# EAGLE design Candle (EAGLE 6.4)
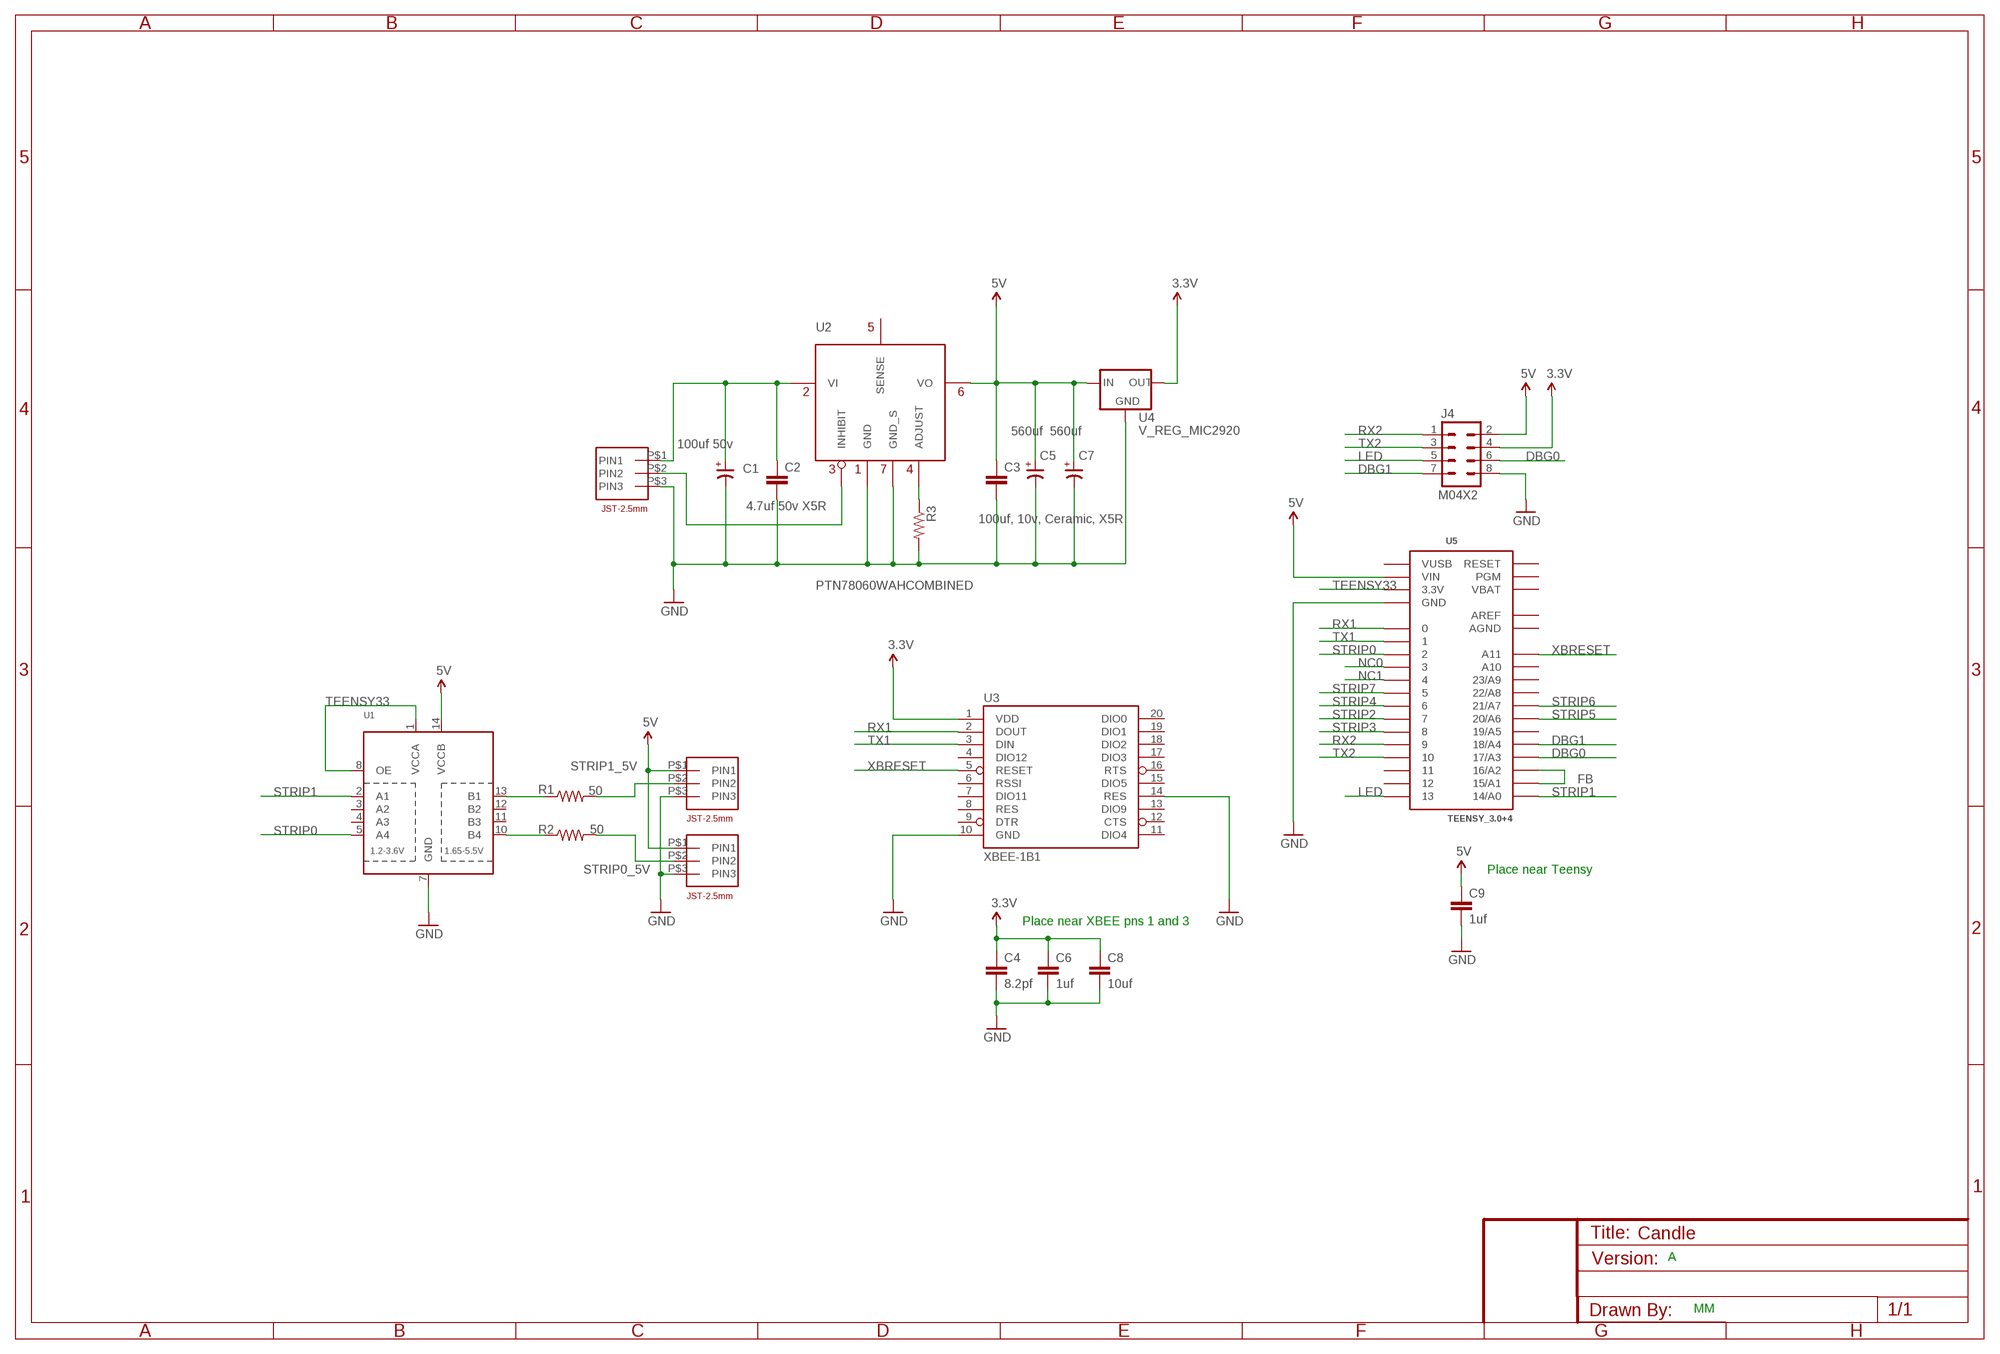
[diagram p0: schematic, sheet 1]

## Parts
C1  100uf 50v  CP-SV-G  [SV-G]
C2  4.7uf 50v X5R  C-EUC3225  [C3225]
C3  100uf, 10v, Ceramic, X5R  C-EUC3225  [C3225]
C4  8.2pf  C-EUC3225  [C3225]
C5  560uf  CP-SV-G  [SV-G]
C6  1uf  C-EUC3225  [C3225]
C7  560uf  CP-SV-G  [SV-G]
C8  10uf  C-EUC3225  [C3225]
C9  1uf  C-EUC3225  [C3225]
J1  JST-XH-2.5MM-SIDE-3  [JST-XH-2.5MM-SIDE-3]
J2  JST-XH-2.5MM-SIDE-3  [JST-XH-2.5MM-SIDE-3]
J3  JST-XH-2.5MM-SIDE-3  [JST-XH-2.5MM-SIDE-3]
J4  M04X2  [2X4]
R1  50  R-US_R0805  [R0805]
R2  50  R-US_R0805  [R0805]
R3  R-US_R0805  [R0805]
U1  TXB0104PWRSOIC14  [SO14]
U2  PTN78060WAHCOMBINED  [COMBINED]
U3  XBEE-1B1  [XBEE-1]
U4  V_REG_MIC2920  [SOT223]
U5  TEENSY_3.0+4  [TEENSY_3.0+4]

## Nets
3.3V: C4.1 C6.1 C8.1 J4.4 U3.1(VDD) U4.3(OUT)
5V: C3.1 C5.+ C7.+ C9.1 J2.P$1(PIN1) J3.P$1(PIN1) J4.2 U1.14(VCCB) U2.VOUT(VO) U2.VOUT_S(VO) U4.1(IN) U5.VIN
DBG0: J4.6 U5.17/A3
DBG1: J4.7 U5.18/A4
FB: U5.15/A1 U5.16/A2
GND: C1.- C2.2 C3.2 C4.2 C5.- C6.2 C7.- C8.2 C9.2 J1.P$3(PIN3) J2.P$3(PIN3) J3.P$3(PIN3) J4.8 R3.2 U1.7(GND) U2.GND U2.GND_S(GND) U2.S/GND(GND_S) U2.S/GND_S(GND_S) U3.10(GND) U3.14(RES) U4.2(GND) U4.4(GND) U5.GND U5.GND1(GND)
LED: J4.5 U5.13
N$2: R1.1 U1.13(B1)
N$3: J1.P$2(PIN2) U2.EN(INHIBIT)
N$7: R2.1 U1.10(B4)
NC0: U5.3
NC1: U5.4
RX1: U3.2(DOUT) U5.0
RX2: J4.1 U5.9
STRIP0: U1.5(A4) U5.2
STRIP0_5V: J3.P$2(PIN2) R2.2
STRIP1: U1.2(A1) U5.14/A0
STRIP1_5V: J2.P$2(PIN2) R1.2
STRIP2: U5.7
STRIP3: U5.8
STRIP4: U5.6
STRIP5: U5.20/A6
STRIP6: U5.21/A7
STRIP7: U5.5
TEENSY33: U1.1(VCCA) U1.8(OE) U5.3.3V U5.3.3V1(3.3V)
TX1: U3.3(DIN) U5.1
TX2: J4.3 U5.10
VADJ: R3.1 U2.ADJUST
VIN: C1.+ C2.1 J1.P$1(PIN1) U2.VIN(VI) U2.VIN_S(VI)
XBRESET: U3.5(RESET) U5.A11
Unconnected: U1.3(A2) U1.4(A3) U1.11(B3) U1.12(B2) U2.SENSE U3.4(DIO12) U3.6(RSSI) U3.7(DIO11) U3.8(RES) U3.9(DTR) U3.11(DIO4) U3.12(CTS) U3.13(DIO9) U3.15(DIO5) U3.16(RTS) U3.17(DIO3) U3.18(DIO2) U3.19(DIO1) U3.20(DIO0) U5.11 U5.12 U5.19/A5 U5.22/A8 U5.23/A9 U5.A10 U5.PGM U5.RESET

## Notes on the sheet
- Place near Teensy
- Place near XBEE pns 1 and 3
- A
- MM

## Power pins joined to a net without a drawn wire
AGND: U5.AGND
AREF: U5.AREF
VBAT: U5.VBAT
VUSB: U5.VUSB

## Library data of the parts
C1 C5 C7 = cap-master:CP-: POLARIZED CAP
C2-C4 C6 C8 C9 = resistor:C-EU: CAPACITOR, European symbol
J1-J3 = MyLibrary:JST-XH-2.5MM-SIDE-3
J4 = SparkFun-Connectors:M04X2: .1" header, two rows of four.
R1-R3 = rcl:R-US_: RESISTOR, American symbol
U1 = SparkFun-DigitalIC:TXB0104PWR: 4-Bit Bi-Directional Level Shifter 1.2V-3.6V (VCCA) to 1.65V-5.5V (VCCB) bi-directional level shifter with auto direction sensing. Max data rate - VCCA 1.8V: 20Mbps (50ns), VCCA 3.3V: 100Mbps (10ns) Digikey: 296-21929-1-ND (TSSOP) IC-11329; PROD_ID: IC-11329
U2 = ptn78060wah:PTN78060WAH
U3 = SparkFun-RF:XBEE-1: Xbee module footprints SMT header is CONN-09042.
U4 = SparkFun-PowerIC:V_REG_MIC2920: MIC2920A (http://www.micrel.com/_PDF/mic2920.pdf) - 400mA output LDO Regulator
U5 = Teensy3.0:TEENSY_3.0+4: Teensy 3.0 board, showing all pins that are easily acessible. See 'AllAnalogPins" and 'AllPins' packages for additional pin holes, as needed. The 'Basic' package has fewer pins.

## Board
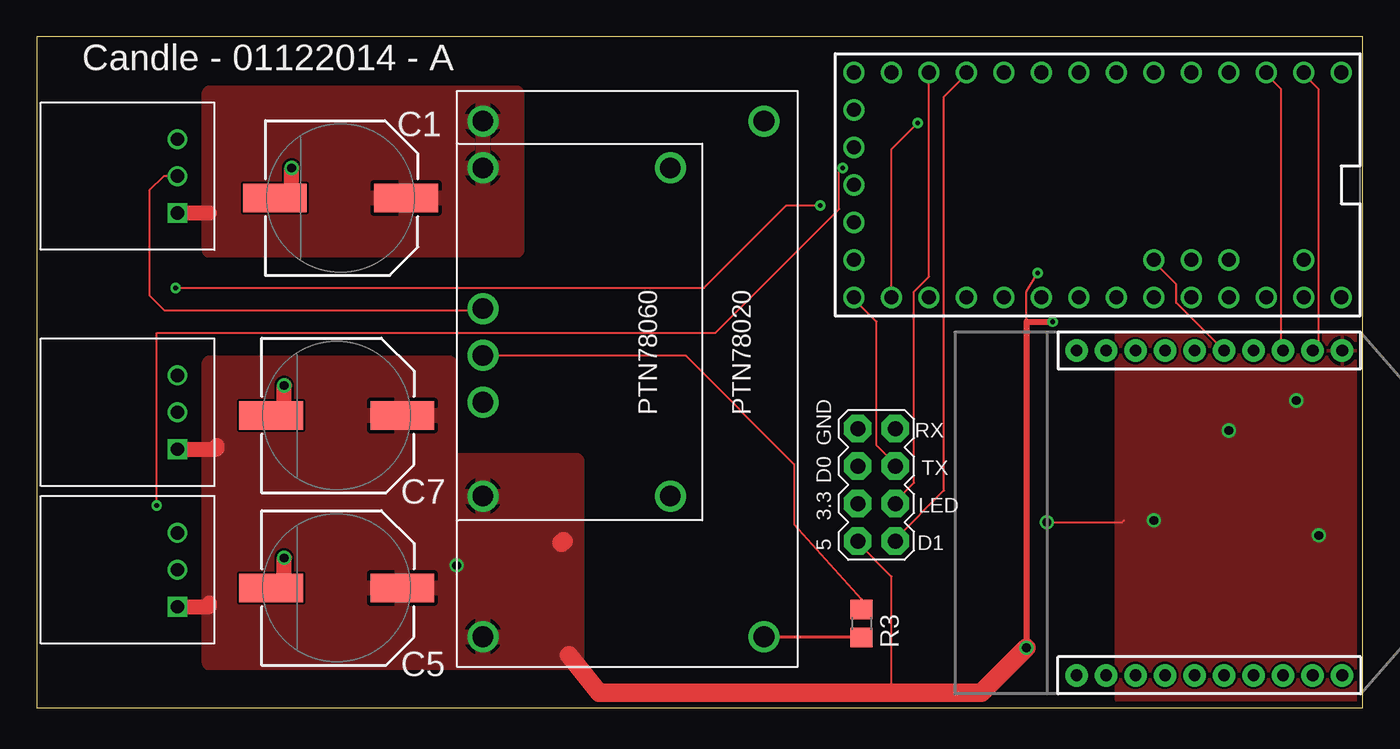
[diagram p1: board, top side]
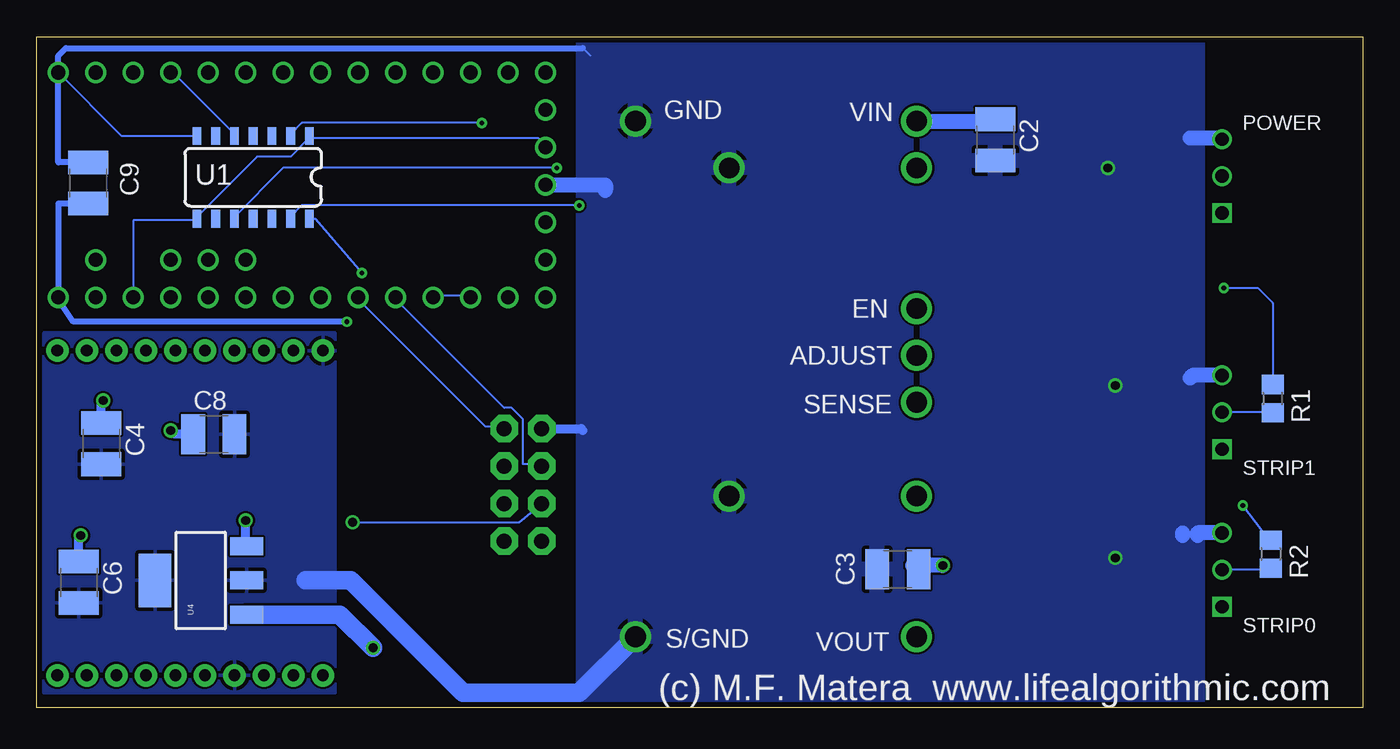
[diagram p2: board, bottom side, seen from below]

Size 89.84 x 45.46 mm. Coordinates in mm from the lower left corner, seen from the top.
Outline: 0,0 89.84,0 89.84,45.46 0,45.46 0,0
Copper layers (1*16): Top 0.0356mm / dielectric 1.5011mm / Bottom 0.0356mm
Design rules "LaenPCBOrder": minimum track width 6mil, minimum drill 13mil, track to track 6mil, track to pad 6mil, pad to pad 6mil, via to via 6mil, smd to smd 6mil, copper to edge 15mil, drill to drill 6mil, minimum pad ring 7mil, minimum via ring 7mil, stop-mask expansion 3mil, vias tented up to drill 0mil, thermal gap 10mil

### Footprints (pad centres in the part's own frame; a part is rotated, then mirrored left to right if it is on the bottom)
SV-G = smd 4.318 x 1.93: + -4.445,0; - 4.445,0
C3225 = smd 1.6 x 2.7: 1 -1.4,0; 2 1.4,0
JST-XH-2.5MM-SIDE-3 = drill 0.9 square: P$1 0,0 | drill 0.9: P$2 2.5,0; P$3 5,0
2X4 = drill 1.016 pad 1.88 octagon: 1 -3.81,-1.27; 2 -3.81,1.27; 3 -1.27,-1.27; 4 -1.27,1.27; 5 1.27,-1.27; 6 1.27,1.27; 7 3.81,-1.27; 8 3.81,1.27
R0805 = smd 1.3 x 1.5: 1 -0.95,0; 2 0.95,0
SO14 = smd 0.6 x 1.2: 1 -3.81,-2.8; 2 -2.54,-2.8; 3 -1.27,-2.8; 4 0,-2.8; 5 1.27,-2.8; 6 2.54,-2.8; 7 3.81,-2.8; 8 3.81,2.8; 9 2.54,2.8; 10 1.27,2.8; 11 0,2.8; 12 -1.27,2.8; 13 -2.54,2.8; 14 -3.81,2.8
COMBINED = drill 1.4: ADJUST 0,0.001; EN -3.175,0.001; GND -15.875,19.051; GND_S -12.7,12.701; S/GND 19.05,19.051; S/GND_S 9.525,12.701; SENSE 3.175,0.001; VIN -15.875,0.001; VIN_S -12.7,0.001; VOUT 19.05,0.001; VOUT_S 9.525,0.001
XBEE-1 = drill 0.8 pad 1.524: 1 -11,20; 2 -11,18; 3 -11,16; 4 -11,14; 5 -11,12; 6 -11,10; 7 -11,8; 8 -11,6; 9 -11,4; 10 -11,2; 11 11,2; 12 11,4; 13 11,6; 14 11,8; 15 11,10; 16 11,12; 17 11,14; 18 11,16; 19 11,18; 20 11,20
SOT223 = smd 1.219 x 2.235: 1 -2.311,-3.099; 2 0,-3.099; 3 2.311,-3.099 | smd 3.6 x 2.2: 4 0,3.099
TEENSY_3.0+4 = drill 0.965: 0 -7.62,13.97; 1 -7.62,11.43; 2 -7.62,8.89; 3 -7.62,6.35; 3.3V 7.62,11.43; 3.3V1 -2.54,-16.51; 4 -7.62,3.81; 5 -7.62,1.27; 6 -7.62,-1.27; 7 -7.62,-3.81; 8 -7.62,-6.35; 9 -7.62,-8.89; 10 -7.62,-11.43; 11 -7.62,-13.97; 12 -7.62,-16.51; 13 7.62,-16.51; 14/A0 7.62,-13.97; 15/A1 7.62,-11.43; 16/A2 7.62,-8.89; 17/A3 7.62,-6.35; 18/A4 7.62,-3.81; 19/A5 7.62,-1.27; 20/A6 7.62,1.27; 21/A7 7.62,3.81; 22/A8 7.62,6.35; 23/A9 7.62,8.89; A10 5.08,6.35; A11 5.08,3.81; AGND 7.62,13.97; AREF 5.08,8.89; GND -7.62,16.51; GND1 0,-16.51; PGM 2.54,-16.51; RESET 5.08,-16.51; VBAT -5.08,-16.51; VIN 7.62,16.51; VUSB 5.08,13.97

### Placement (x,y rotation side)
C1  20.57,34.54 180 top
C2  24.89,38.48 270 bottom
C3  31.5,9.4 180 bottom
C4  85.47,17.91 270 bottom
C5  20.32,8.13 180 top
C6  87,8.51 270 bottom
C7  20.32,19.81 180 top
C8  77.85,18.54 0 bottom
C9  86.36,35.56 90 bottom
J1  9.53,33.53 90 top
J2  9.53,17.53 90 top
J3  9.53,6.86 90 top
J4  56.9,15.11 90 top
R1  6.1,20.95 270 bottom
R2  6.22,10.41 270 bottom
R3  55.88,5.71 270 top
U1  75.18,35.94 180 bottom
U2  30.23,23.88 270 top
U3  68.45,13.21 270 top
U4  78.74,8.64 90 bottom
U5  71.88,35.43 270 top

### Tracks (layer width: path | path; a pad name or v marks a point on that pad's centre or on a via)
3.3V  (via drill 0.6)
  Top 0.152: 55.63,13.72 J4.4 | v68.45,12.57 73.53,12.57 73.66,12.7
  Bottom 0.152: v68.45,12.57 57.15,12.57 J4.4
  Bottom 0.61: U4.3 75.69,10.95 v75.69,12.7 | C8.1 80.52,18.54 v80.77,18.8 | C4.1 85.47,20.7 v85.34,20.83 | C6.1 87,11.56 v86.87,11.68
  pour Top: 73.15,25.4 89.41,25.4 89.41,0.51 73.15,0.51
5V  (via drill 0.33, 0.6)
  Top 0.152: 57.91,1.02 57.91,8.89 55.63,11.18 J4.2 | v67.82,29.46 67.06,28.19 67.06,26.16
  Top 0.406: v68.83,26.16 67.06,26.16 v67.06,4.06
  Top 1.016: J3.P$1 11.68,6.86 11.68,7.11 | J2.P$1 12.19,17.53 12.19,17.78
  Top 1.27: 35.69,11.3 35.56,11.18 | v67.06,4.06 64.01,1.02 57.91,1.02 38.1,1.02 36.07,3.56
  Bottom 0.152: 88.39,27.69 U5.VIN | U1.14 70.99,33.14 v67.82,29.46
  Bottom 0.406: 88.39,27.69 87.38,26.16 v68.83,26.16 | C9.1 88.39,34.16 U5.VIN
  Bottom 1.016: C3.1 30.48,9.65 29.97,10.16 29.46,9.65 v28.45,9.65
  Bottom 1.27: v67.06,4.06 69.32,6.33 U4.1
  pour Top: 11.68,23.37 27.94,23.37 27.94,16.76 36.58,16.76 36.58,3.05 11.68,3.05
DBG0
  Bottom 0.152: U5.17/A3 65.53,27.69 58.17,20.32 57.66,20.32 56.9,19.56 56.9,16.51 55.63,16.51 J4.6
DBG1
  Bottom 0.152: U5.18/A4 68.07,27.69 59.44,19.05 58.17,19.05 J4.7
FB
  Bottom 0.152: U5.15/A1 60.45,27.94 62.99,27.94 U5.16/A2
GND  (via drill 0.6)
  Top 0.152: 55.63,19.05 J4.8
  Top 0.203: U2.S/GND 55.82,4.83 R3.2
  Top 1.016: 15.24,8.13 C5.- 16.76,8.13 v16.76,10.16 | 15.24,19.81 C7.- 16.76,19.81 v16.76,21.84 | 15.75,34.54 C1.- 17.27,34.54 v17.27,36.58
  Bottom 0.152: 52.83,44.7 52.32,44.2 | U1.7 84.08,38.74 U5.GND
  Bottom 0.406: 52.83,44.7 87.88,44.7 88.39,44.2 U5.GND 88.39,36.96 C9.2
  Bottom 0.61: J4.8 52.96,18.92 52.83,18.8
  Bottom 1.016: J1.P$3 9.65,38.61 11.68,38.61 | 12.19,11.86 12.19,11.68 | J2.P$3 11.51,22.53 11.68,22.35 | U5.GND1 51.31,35.43 51.31,35.05 | J3.P$3 11.18,11.86 11.18,11.68
  Bottom 1.27: U2.S/GND 53.09,1.02 60.96,1.02 68.58,8.64 71.63,8.64
  pour Bottom: 11.18,45.21 52.83,45.21 52.83,0.51 11.18,0.51
  pour Bottom: 69.6,25.4 89.41,25.4 89.41,1.02 69.6,1.02
LED
  Top 0.152: U5.13 55.37,27.69 56.9,26.16 56.9,17.78 58.17,16.51 J4.5
N$2  (via drill 0.33)
  Top 0.152: v9.4,28.45 45.21,28.45 50.8,34.04 v53.09,34.04
  Bottom 0.152: v53.09,34.04 71.88,34.04 72.64,33.27 U1.13 | 6.1,22.1 R1.1 6.1,27.43 7.11,28.45 v9.4,28.45
N$3
  Top 0.152: 30.23,27.18 U2.EN 30.1,26.92 8.64,26.92 7.62,27.94 7.62,35.05 8.6,36.03 J1.P$2
N$7  (via drill 0.33)
  Top 0.152: v54.61,36.58 54.36,36.32 54.36,33.78 45.97,25.4 8.13,25.4 v8.13,13.72
  Bottom 0.152: v54.61,36.58 73.15,36.58 76.45,33.27 U1.10 | v8.13,13.72 6.35,11.43 R2.1
RX1
  Top 0.152: U5.0 85.85,42.93 86.87,41.91 86.87,24.64 86.61,24.38 U3.2
RX2
  Top 0.152: U5.9 62.99,42.93 61.47,41.4 61.47,14.73 58.17,11.43 J4.1
STRIP0
  Bottom 0.152: U1.5 76.45,38.86 80.52,42.93 80.77,42.93 U5.2
STRIP0_5V
  Bottom 0.152: R2.2 6.35,9.4 9.4,9.4 J3.P$2
STRIP1  (via drill 0.33)
  Top 0.152: v59.69,39.62 57.91,37.85 U5.14/A0
  Bottom 0.152: v59.69,39.62 71.88,39.62 72.64,38.86 U1.2
STRIP1_5V
  Bottom 0.152: R1.2 6.1,20.07 9.4,20.07 J2.P$2
TEENSY33
  Bottom 0.152: 71.37,38.61 72.64,37.34 74.93,37.34 78.99,33.27 U1.8 78.99,33.02 83.31,33.02 U5.3.3V | 71.37,38.61 55.88,38.61 55.37,38.1 U5.3.3V1 | 71.37,38.61 U1.1
TX1
  Top 0.152: U5.1 83.31,42.93 84.33,41.91 84.33,24.38 U3.3
TX2
  Top 0.152: U5.10 60.45,29.21 59.44,28.19 59.44,15.24 58.17,13.97 J4.3
VADJ
  Top 0.152: R3.1 55.88,7.37 51.31,12.45 51.31,16.51 43.94,23.88 30.48,23.88 U2.ADJUST
VIN
  Top 1.016: J1.P$1 11.68,33.53
  Bottom 1.016: U2.VIN 24.89,39.75 C2.1
  pour Top: 11.68,41.66 32.51,41.66 32.51,30.99 11.68,30.99
XBRESET
  Top 0.152: U5.A11 75.69,30.23 77.22,28.7 77.22,27.43 80.26,24.38 U3.5

### Text on the board
tPlace: Candle - 01122014 - A | RX | GND | TX | D0 | LED | 3.3 | D1 | 5
bPlace: POWER | STRIP1 | STRIP0 | (c) M.F. Matera www.lifealgorithmic.com